# EAGLE design VCO_knobs_and_jacks_edited (EAGLE 9.6.2)
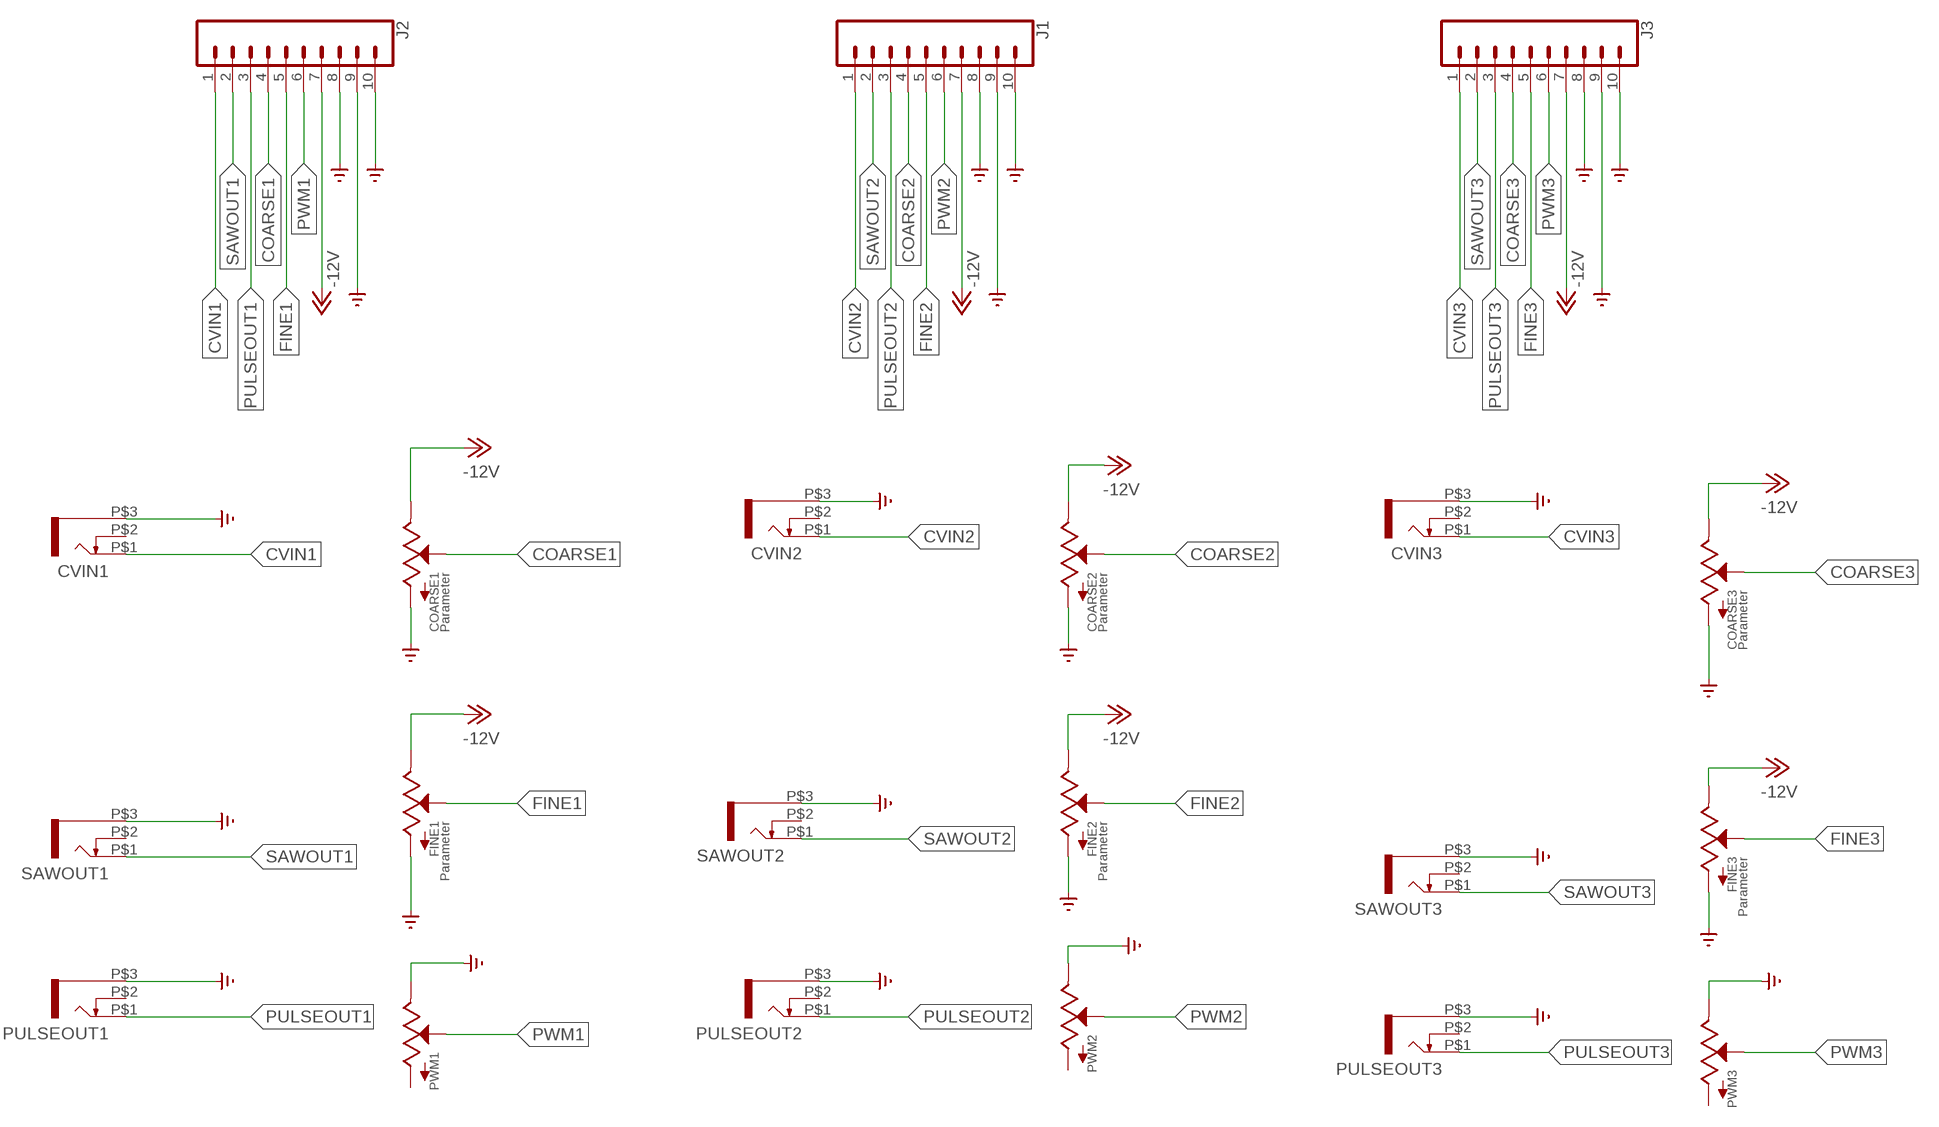
[diagram p0: schematic, sheet 1]

## Parts
COARSE1  POTZEPHPOT  [OG-POTS_ALPS_POT_VERTICAL]
COARSE2  POTZEPHPOT  [OG-POTS_ALPS_POT_VERTICAL]
COARSE3  POTZEPHPOT  [OG-POTS_ALPS_POT_VERTICAL]
CVIN1  WQP-PJ301M-12_JACK  [WQP-PJ301M-12_JACK]
CVIN2  WQP-PJ301M-12_JACK  [WQP-PJ301M-12_JACK]
CVIN3  WQP-PJ301M-12_JACK  [WQP-PJ301M-12_JACK]
FINE1  POTZEPHPOT  [OG-POTS_ALPS_POT_VERTICAL]
FINE2  POTZEPHPOT  [OG-POTS_ALPS_POT_VERTICAL]
FINE3  POTZEPHPOT  [OG-POTS_ALPS_POT_VERTICAL]
J1  CONN_10"  [1X10]
J2  CONN_10"  [1X10]
J3  CONN_10"  [1X10]
PULSEOUT1  WQP-PJ301M-12_JACK  [WQP-PJ301M-12_JACK]
PULSEOUT2  WQP-PJ301M-12_JACK  [WQP-PJ301M-12_JACK]
PULSEOUT3  WQP-PJ301M-12_JACK  [WQP-PJ301M-12_JACK]
PWM1  POTZEPHPOT  [OG-POTS_ALPS_POT_VERTICAL]
PWM2  POTZEPHPOT  [OG-POTS_ALPS_POT_VERTICAL]
PWM3  POTZEPHPOT  [OG-POTS_ALPS_POT_VERTICAL]
SAWOUT1  WQP-PJ301M-12_JACK  [WQP-PJ301M-12_JACK]
SAWOUT2  WQP-PJ301M-12_JACK  [WQP-PJ301M-12_JACK]
SAWOUT3  WQP-PJ301M-12_JACK  [WQP-PJ301M-12_JACK]

## Nets
-12V: COARSE1.P$1(E) COARSE2.P$1(E) COARSE3.P$1(E) FINE1.P$1(E) FINE2.P$1(E) FINE3.P$1(E) J1.7 J2.7 J3.7
COARSE1: COARSE1.P$2(S) J2.4
COARSE2: COARSE2.P$2(S) J1.4
COARSE3: COARSE3.P$2(S) J3.4
CVIN1: CVIN1.P$1 J2.1
CVIN2: CVIN2.P$1 J1.1
CVIN3: CVIN3.P$1 J3.1
FINE1: FINE1.P$2(S) J2.5
FINE2: FINE2.P$2(S) J1.5
FINE3: FINE3.P$2(S) J3.5
GND: COARSE1.P$3(A) COARSE2.P$3(A) COARSE3.P$3(A) CVIN1.P$3 CVIN2.P$3 CVIN3.P$3 FINE1.P$3(A) FINE2.P$3(A) FINE3.P$3(A) J1.8 J1.9 J1.10 J2.8 J2.9 J2.10 J3.8 J3.9 J3.10 PULSEOUT1.P$3 PULSEOUT2.P$3 PULSEOUT3.P$3 PWM1.P$1(E) PWM2.P$1(E) PWM3.P$1(E) SAWOUT1.P$3 SAWOUT2.P$3 SAWOUT3.P$3 ; supply symbol labelled SUPPLY0_GND_
PULSEOUT1: J2.3 PULSEOUT1.P$1
PULSEOUT2: J1.3 PULSEOUT2.P$1
PULSEOUT3: J3.3 PULSEOUT3.P$1
PWM1: J2.6 PWM1.P$2(S)
PWM2: J1.6 PWM2.P$2(S)
PWM3: J3.6 PWM3.P$2(S)
SAWOUT1: J2.2 SAWOUT1.P$1
SAWOUT2: J1.2 SAWOUT2.P$1
SAWOUT3: J3.2 SAWOUT3.P$1
Unconnected: CVIN1.P$2 CVIN2.P$2 CVIN3.P$2 PULSEOUT1.P$2 PULSEOUT2.P$2 PULSEOUT3.P$2 PWM1.P$3(A) PWM2.P$3(A) PWM3.P$3(A) SAWOUT1.P$2 SAWOUT2.P$2 SAWOUT3.P$2

## Library data of the parts
COARSE1-COARSE3 FINE1-FINE3 PWM1-PWM3 = EurorackModularParts:POT; DESC: Parameter
CVIN1-CVIN3 PULSEOUT1-PULSEOUT3 SAWOUT1-SAWOUT3 = thonkiconn:WQP-PJ301M-12_JACK
J1-J3 = SparkFun-Connectors:CONN_10: Multi connection point. Often used as Generic Header-pin footprint for 0.1 inch spaced/style header connections On any of the 0.1 inch spaced packages, you can populate with these: Break Away Headers - Straight <https://www.sparkfun.com/products/116> (PRT-00116) Break Away Male Headers - Right Angle <https://www.sparkfun.com/products/553> (PRT-00553) Female Headers <https://www.sparkfun.com/products/115> (PRT-00115) Break Away Headers - Machine Pin <https://www.sparkfun.com/products/117> (PRT-00117) Break Away Female Headers - Swiss Machine Pin <https://www.sparkfun.com/products/743> (PRT-00743) Arduino Stackable Header - 10 Pin <https://www.sparkfun.com/products/11376> (PRT-11376) For SCREWTERMINALS and SPRING TERMINALS visit here: Screw Terimnals on SparkFun.com <https://www.sparkfun.com/search/results?term=Screw+Terminals> (5mm/3.5mm/2.54mm spacing) This device is also useful as a general connection point to wire up your design to another part of your project. Our various solder wires solder well into these plated through hole pads. Hook-Up Wire - Assortment (Stranded, 22 AWG) <https://www.sparkfun.com/products/11375> (PRT-11375) Hook-Up Wire - Assortment (Solid Core, 22 AWG) <https://www.sparkfun.com/products/11367> (PRT-11367) View the entire wire category on our website here <https://www.sparkfun.com/categories/141> Special notes: Molex polarized connector foot print use with SKU : PRT-08231 with associated crimp pins and housings. 1MM SMD Version SKU: PRT-10208 NOTES ON THE VARIANTS LOCK and LOCK_LONGPADS... This footprint was designed to help hold the alignment of a through-hole component (i.e. 6-pin header) while soldering it into place. You may notice that each hole has been shifted either up or down by 0.005 of an inch from it's more standard position (which is a perfectly straight line). This slight alteration caused the pins (the squares in the middle) to touch the edges of the holes. Because they are alternating, it causes a "brace" to hold the component in place. 0.005 has proven to be the perfect amount of "off-center" position when using our standard breakaway headers. Although looks a little odd when you look at the bare footprint, once you have a header in there, the alteration is very hard to notice. Also,if you push a header all the way into place, it is covered up entirely on the bottom side.; PROD_ID: CONN-11563

## Board
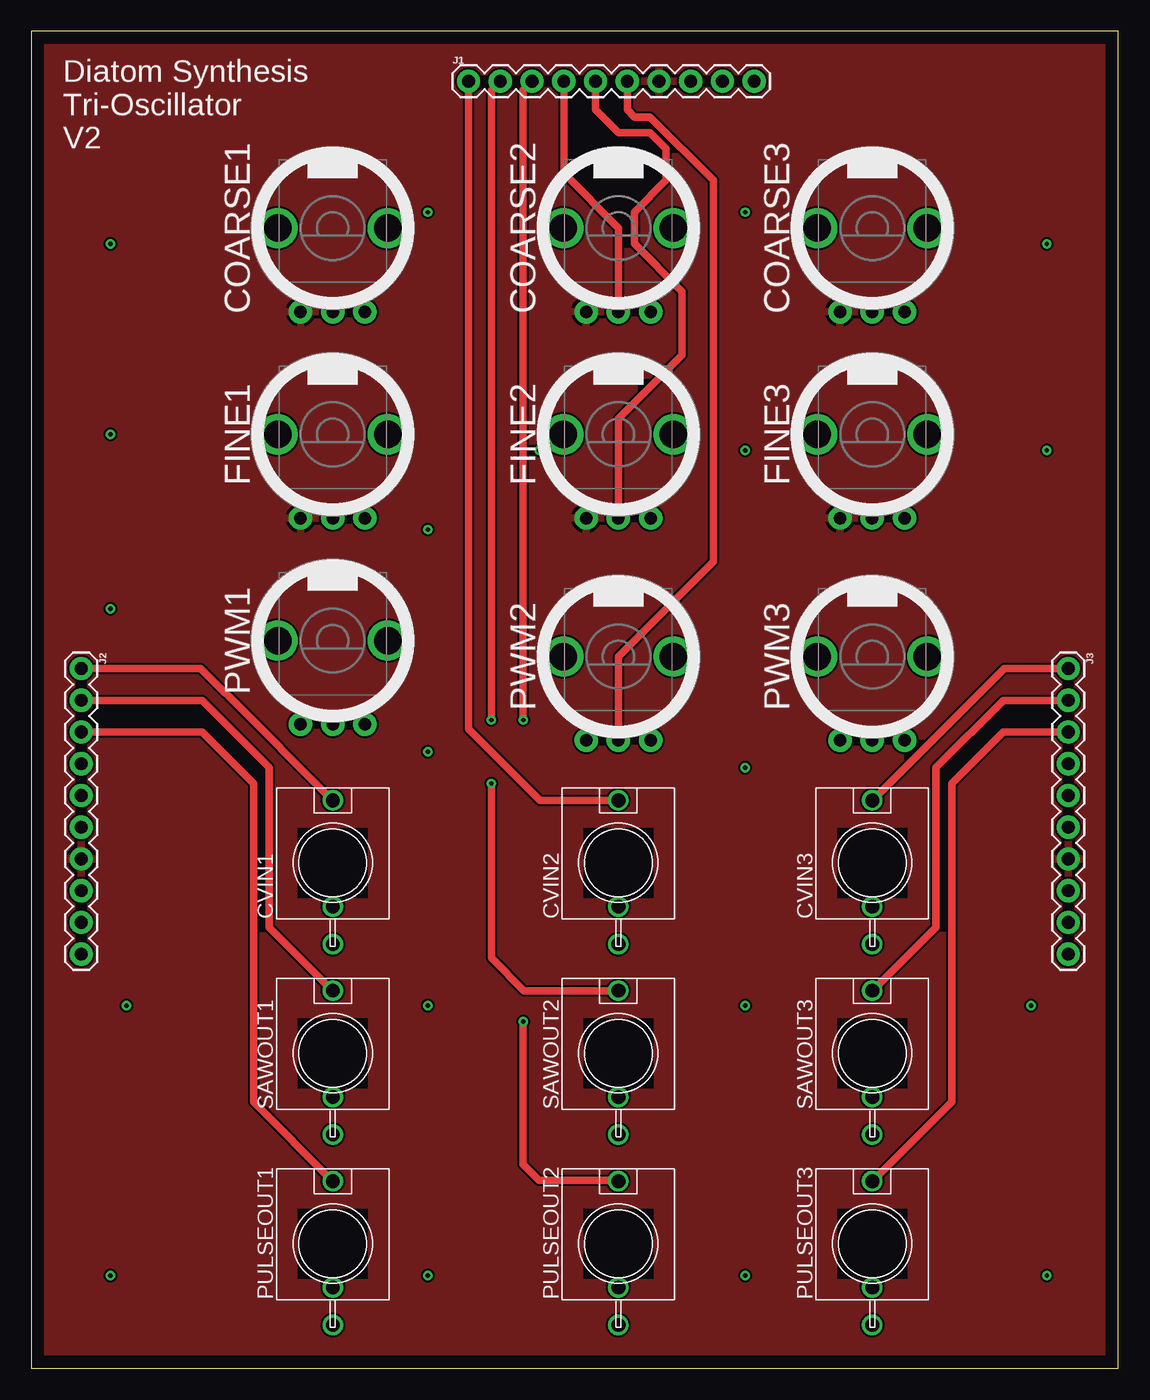
[diagram p1: board, top side]
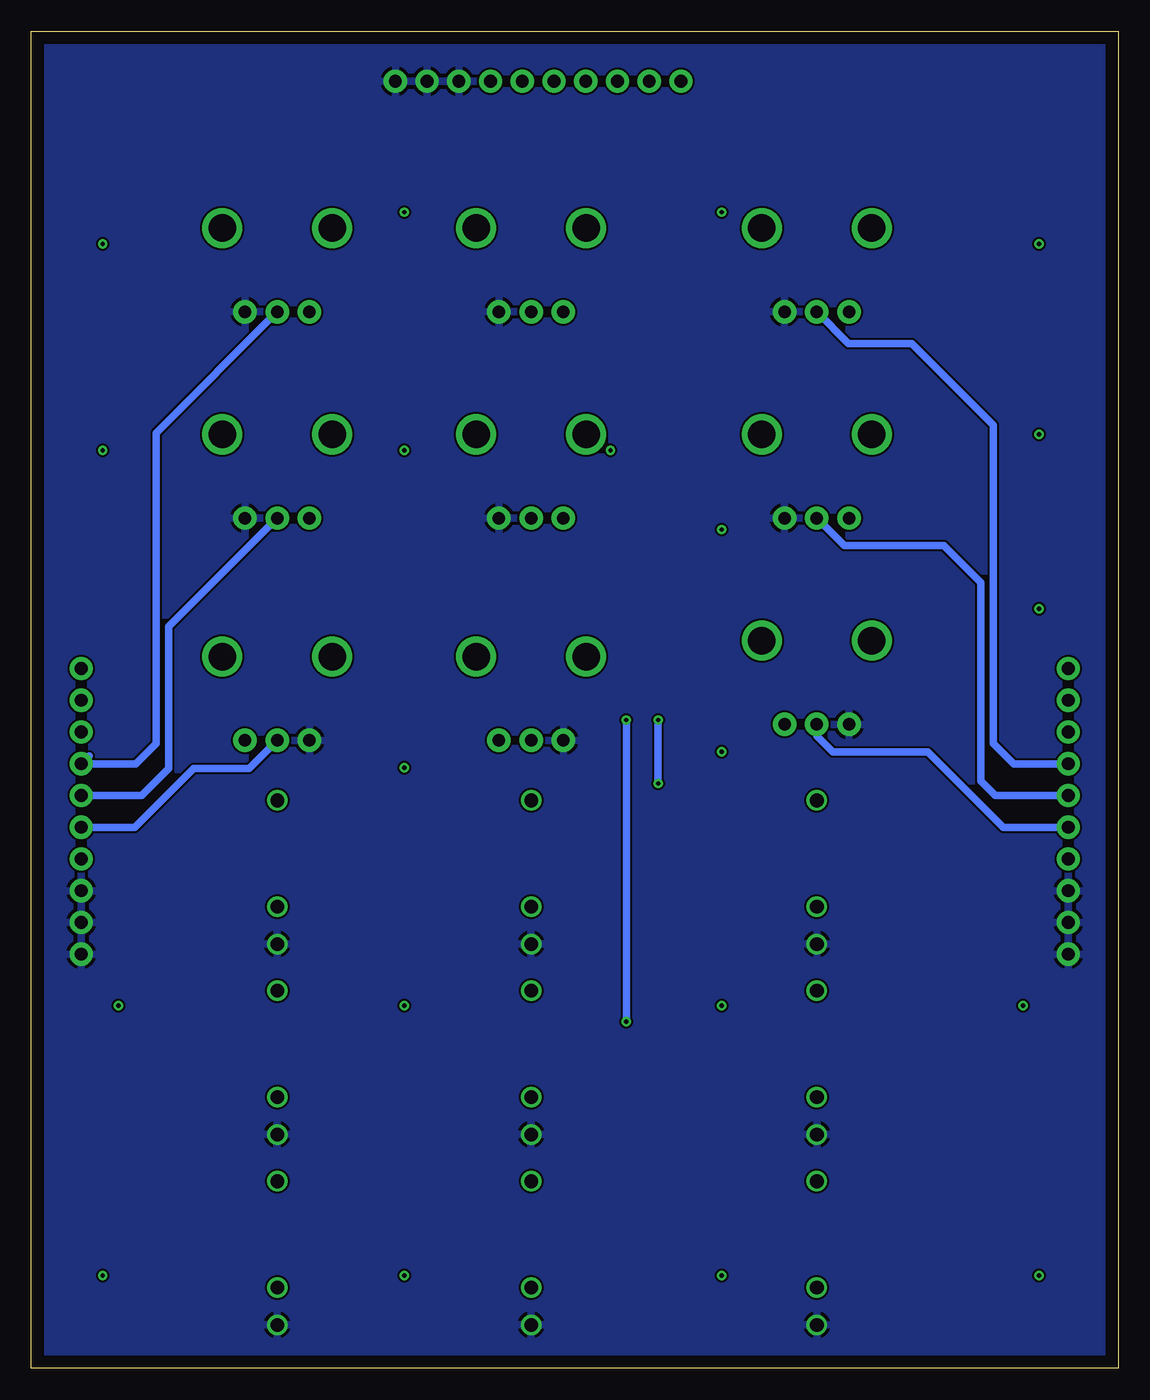
[diagram p2: board, bottom side, seen from below]

Size 87 x 107 mm. Coordinates in mm from the lower left corner, seen from the top.
Outline: 0,0 87,0 87,107 0,107 0,0
Copper layers (1*16): Top 0.035mm / dielectric 1.5mm / Bottom 0.035mm
Design rules "default": minimum track width 6mil, minimum drill 0.35mm, track to track 6mil, track to pad 6mil, pad to pad 6mil, via to via 6mil, smd to smd 6mil, copper to edge 40mil, drill to drill 6mil, minimum pad ring 10mil, minimum via ring 8mil, stop-mask expansion 4mil, vias tented up to drill 0mil, thermal gap 10mil

### Footprints (pad centres in the part's own frame; a part is rotated, then mirrored left to right if it is on the bottom)
OG-POTS_ALPS_POT_VERTICAL = drill 1 pad 1.88: P$1 -2.58,-6.7; P$2 0,-6.7; P$3 2.58,-6.7 | drill 2.2 pad 3.175: P$4 4.4,0; P$5 -4.4,0
WQP-PJ301M-12_JACK = drill 1.1: P$1 0,5; P$2 0,-3.5; P$3 0,-6.5
1X10 = drill 1.016 pad 1.88: 1 0,0; 2 2.54,0; 3 5.08,0; 4 7.62,0; 5 10.16,0; 6 12.7,0; 7 15.24,0; 8 17.78,0; 9 20.32,0; 10 22.86,0

### Placement (x,y rotation side)
COARSE1  24.13,91.25 0 top
COARSE2  46.99,91.25 0 top
COARSE3  67.31,91.25 0 top
CVIN1  24.13,40.45 0 top
CVIN2  46.99,40.45 0 top
CVIN3  67.31,40.45 0 top
FINE1  24.13,74.74 0 top
FINE2  46.99,74.74 0 top
FINE3  67.31,74.74 0 top
J1  35,103 0 top
J2  4,56 270 top
J3  83,56 270 top
PULSEOUT1  24.13,9.97 0 top
PULSEOUT2  46.99,9.97 0 top
PULSEOUT3  67.31,9.97 0 top
PWM1  24.13,58.23 0 top
PWM2  46.99,56.96 0 top
PWM3  67.31,56.96 0 top
SAWOUT1  24.13,25.21 0 top
SAWOUT2  46.99,25.21 0 top
SAWOUT3  67.31,25.21 0 top

### Tracks (layer width: path | path; a pad name or v marks a point on that pad's centre or on a via)
-12V
  pour Top: 0,107.49 0,0 87.63,0 87.63,107.49
COARSE1
  Bottom 0.61: COARSE1.P$2 21.59,82.01 16.51,82.01 11.75,77.25 11.43,76.93 10,75.5 10,50 8.38,48.38 J2.4
COARSE2
  Top 0.61: COARSE2.P$2 46.99,91.25 42.62,95.62 J1.4
COARSE3
  Bottom 0.61: 82.38,49 J3.4 78.62,48.38 77,50 77,74.86 COARSE3.P$2
CVIN1
  Top 0.61: CVIN1.P$1 15.79,53.79 15.58,54 13.58,56 J2.1
CVIN2
  Top 0.61: CVIN2.P$1 40.72,45.45 35,51.17 J1.1
CVIN3
  Top 0.61: J3.1 77.86,56 CVIN3.P$1
FINE1
  Bottom 0.61: FINE1.P$2 21.94,65.85 13.97,65.85 13.06,64.94 12.7,64.58 11,62.88 11,47 9.84,45.84 J2.5
FINE2
  Top 0.61: FINE2.P$2 46.99,76.01 52.07,81.09 52.07,86.17 48.26,89.98 48.26,92.52 50.8,95.06 50.8,97.6 49.53,98.87 46.99,98.87 45.16,100.7 J1.5
FINE3
  Bottom 0.61: J3.5 78.16,45.84 76,48 76,59.35 FINE3.P$2
GND
  pour Bottom: 0,107.49 0,0 87.63,0 87.63,107.49
N$1  (via drill 0.35)
  other vias: 6.35,7.43
N$2  (via drill 0.35)
  other vias: 31.75,49.34
N$3  (via drill 0.35)
  other vias: 57.15,48.07
N$4  (via drill 0.35)
  other vias: 31.75,67.12
N$5  (via drill 0.35)
  other vias: 81.28,89.98
N$6  (via drill 0.35)
  other vias: 6.35,89.98
N$8  (via drill 0.35)
  other vias: 40.64,73.47
N$9  (via drill 0.35)
  other vias: 57.15,73.47
N$10  (via drill 0.35)
  other vias: 6.35,74.74
N$11  (via drill 0.35)
  other vias: 6.35,60.77
N$12  (via drill 0.35)
  other vias: 7.62,29.02
N$13  (via drill 0.35)
  other vias: 31.75,29.02
N$14  (via drill 0.35)
  other vias: 31.75,7.43
N$15  (via drill 0.35)
  other vias: 57.15,29.02
N$16  (via drill 0.35)
  other vias: 57.15,7.43
N$17  (via drill 0.35)
  other vias: 81.28,7.43
N$18  (via drill 0.35)
  other vias: 80.01,29.02
N$19  (via drill 0.35)
  other vias: 81.28,73.47
N$20  (via drill 0.35)
  other vias: 57.15,92.52
N$21  (via drill 0.35)
  other vias: 31.75,92.52
PULSEOUT1
  Top 0.61: PULSEOUT1.P$1 17.78,21.32 17.78,46.8 15.79,48.79 15.66,48.92 13.66,50.92 J2.3
PULSEOUT2  (via drill 0.35)
  Top 0.61: PULSEOUT2.P$1 46.91,15.05 40.64,15.05 39.37,16.32 v39.37,27.75 | v39.37,51.88 39.37,102.29 J1.3
  Bottom 0.61: v39.37,27.75 v39.37,51.88
PULSEOUT3
  Top 0.61: PULSEOUT3.P$1 73.66,21.32 73.66,46.8 77.78,50.92 J3.3
PWM1
  Bottom 0.61: PWM1.P$2 24.13,50.61 22.86,49.34 15.24,49.34 9.2,43.3 J2.6
PWM2
  Top 0.61: PWM2.P$2 46.99,56.96 54.61,64.58 54.61,95.06 49.53,100.14 48.26,100.14 47.7,100.7 J1.6
PWM3
  Bottom 0.61: J3.6 78.7,43.3 74,48 69.57,48 PWM3.P$2
SAWOUT1
  Top 0.61: SAWOUT1.P$1 19.05,35.29 19.05,48.07 13.66,53.46 J2.2
SAWOUT2  (via drill 0.35)
  Top 0.61: SAWOUT2.P$1 39.45,30.21 36.83,32.83 v36.83,46.8 | v36.83,51.88 36.83,102.29 J1.2
  Bottom 0.61: v36.83,46.8 v36.83,51.88
SAWOUT3
  Top 0.61: SAWOUT3.P$1 72.39,35.29 72.39,48.07 77.78,53.46 J3.2

### Text on the board
tSilk: Diatom Synthesis / Tri-Oscillator / V2